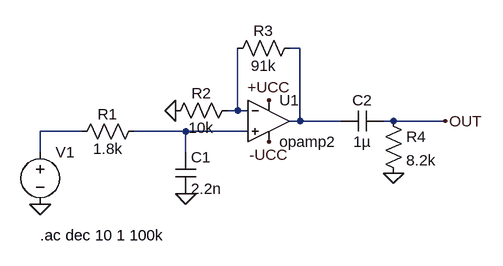
[diagram p0: schematic lista5_zad4.asc]
lista5_zad4.asc, the LTspice schematic file:
Version 4.1
SHEET 1 880 680
WIRE 416 -32 400 -32
WIRE 320 64 320 -32
WIRE 320 64 304 64
WIRE 336 64 320 64
WIRE 416 80 416 -32
WIRE 416 80 400 80
WIRE 480 80 416 80
WIRE 560 80 544 80
WIRE 640 80 560 80
WIRE 80 96 16 96
WIRE 240 96 160 96
WIRE 336 96 240 96
WIRE 16 128 16 96
WIRE 240 128 240 96
FLAG 16 208 0
FLAG 224 64 0
FLAG 240 192 0
FLAG 560 160 0
FLAG 640 80 OUT
FLAG 368 48 +UCC
FLAG 368 112 -UCC
SYMBOL voltage 16 112 R0
WINDOW 123 0 0 Left 0
WINDOW 39 0 0 Left 0
SYMATTR InstName V1
SYMATTR Value ""
SYMBOL res 176 80 R90
WINDOW 0 5 56 VBottom 2
WINDOW 3 27 56 VTop 2
SYMATTR InstName R1
SYMATTR Value 1.8k
SYMBOL cap 224 128 R0
SYMATTR InstName C1
SYMATTR Value 2.2n
SYMBOL OpAmps\\opamp2 368 16 R0
SYMATTR InstName U1
SYMBOL res 320 48 R90
WINDOW 0 5 56 VBottom 2
WINDOW 3 27 56 VTop 2
SYMATTR InstName R2
SYMATTR Value 10k
SYMBOL res 416 -48 R90
WINDOW 0 5 56 VBottom 2
WINDOW 3 27 56 VTop 2
SYMATTR InstName R3
SYMATTR Value 91k
SYMBOL cap 544 64 R90
WINDOW 0 0 32 VBottom 2
WINDOW 3 32 32 VTop 2
SYMATTR InstName C2
SYMATTR Value 1µ
SYMBOL res 544 64 R0
SYMATTR InstName R4
SYMATTR Value 8.2k
TEXT 16 256 Left 2 !.ac dec 10 1 100k

The netlist it stands for:
* lista5_zad4.asc
V1 N003 0
R1 N004 N003 1.8k
C1 N004 0 2.2n
X§U1 N004 N002 +UCC -UCC N001 opamp2  ; pins In+ In- V+ V- OUT
R2 N002 0 10k
R3 N001 N002 91k
C2 OUT N001 1µ
R4 OUT 0 8.2k
.ac dec 10 1 100k
.backanno
.end